# EAGLE design J-Link_PCB (EAGLE 9.6.2)
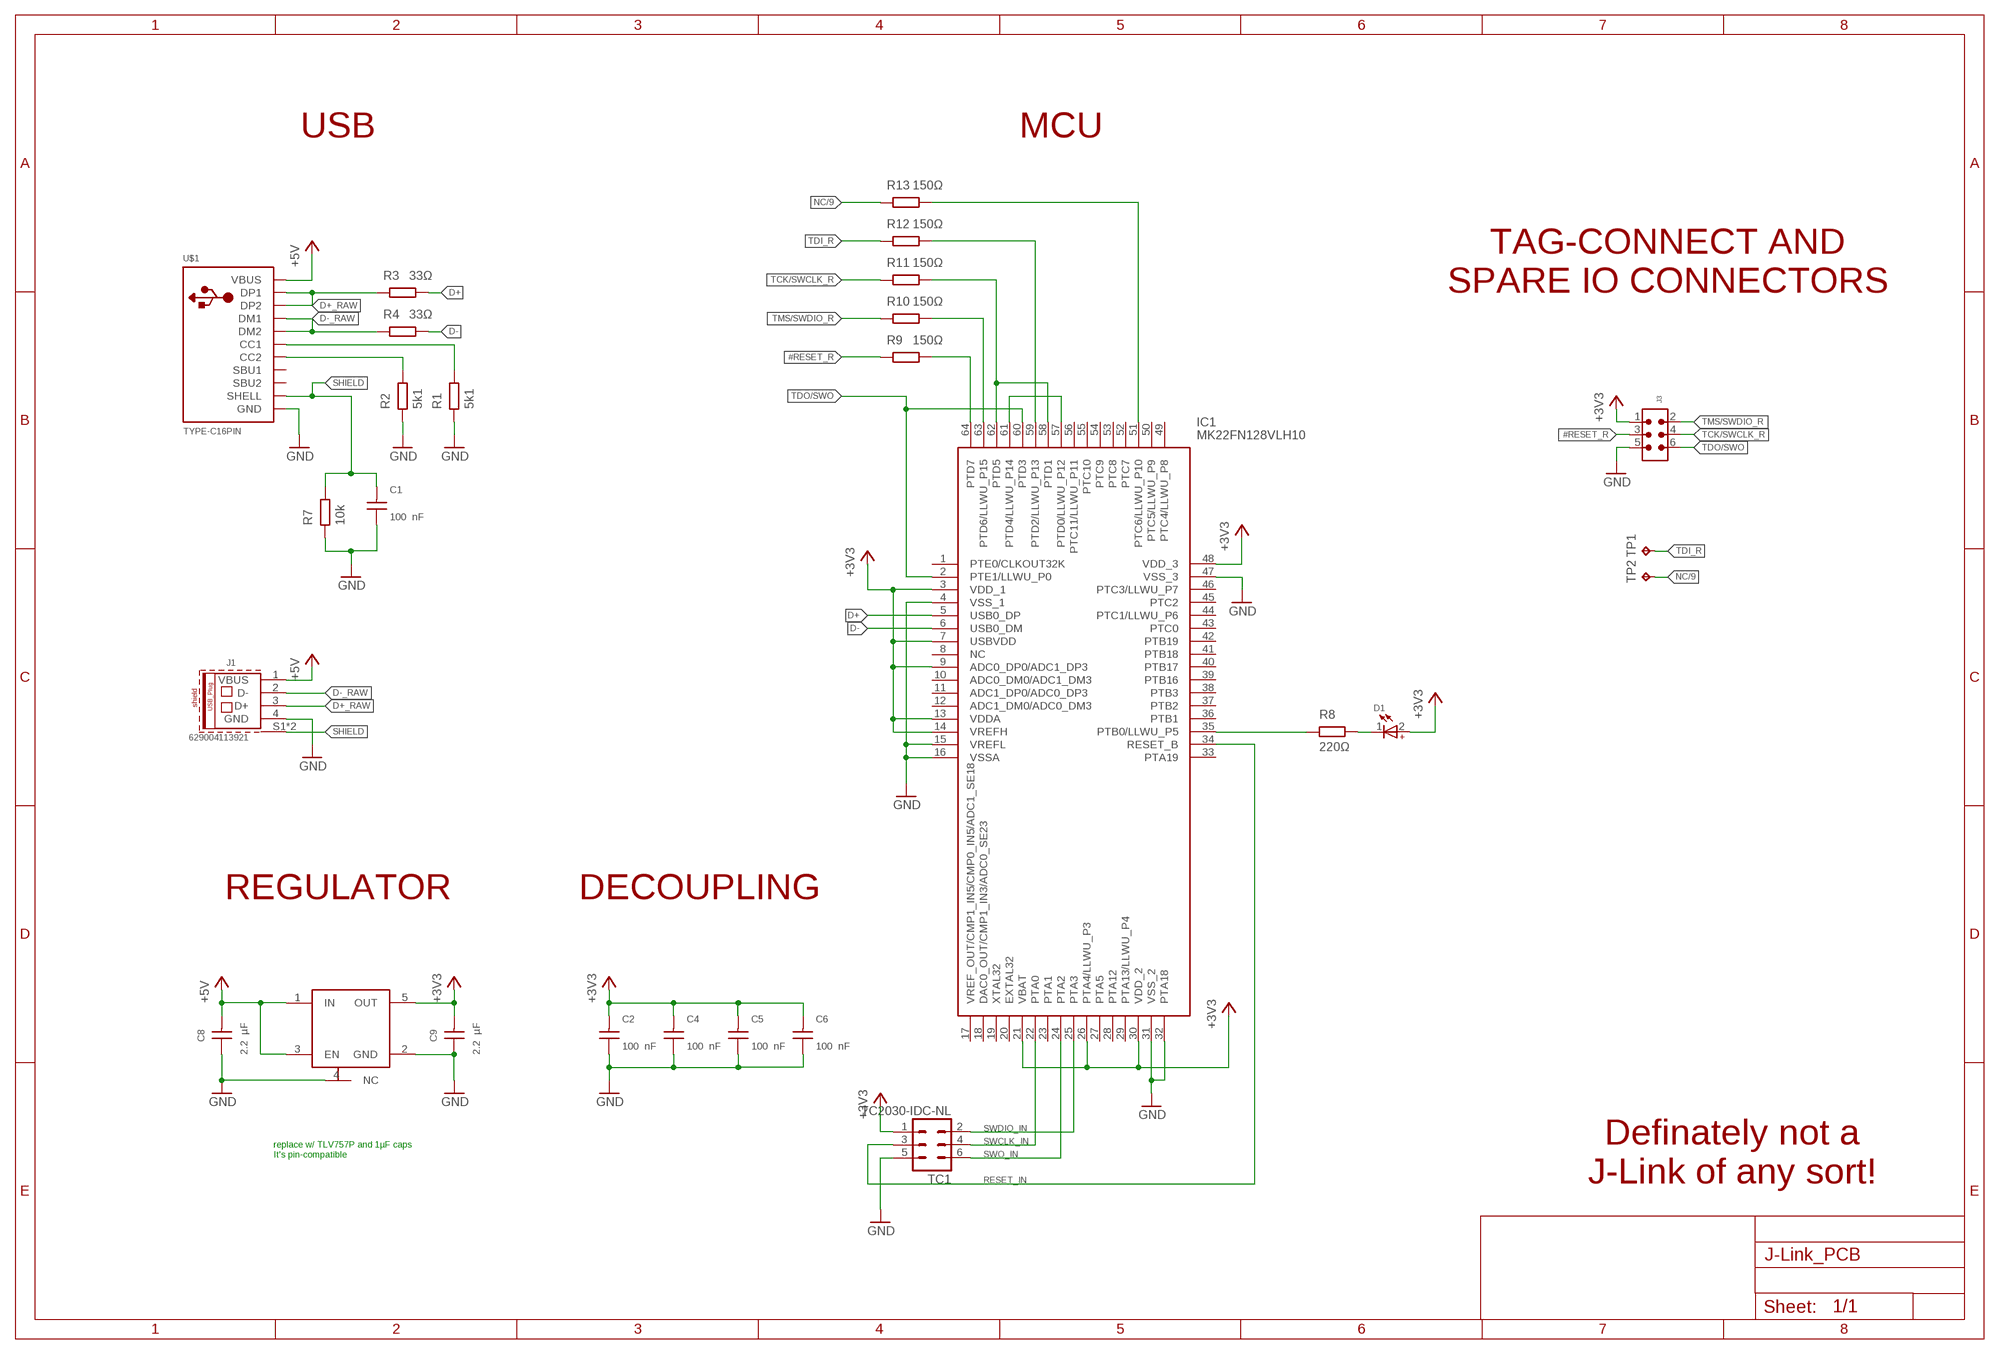
[diagram p0: schematic, sheet 1]

## Parts
C1  100 nF  WCAP-CSGP_0402_885012205037_16V(DC)  [WCAP-CSGP_0402]
C2  100 nF  WCAP-CSGP_0402_885012205037_16V(DC)  [WCAP-CSGP_0402]
C4  100 nF  WCAP-CSGP_0402_885012205037_16V(DC)  [WCAP-CSGP_0402]
C5  100 nF  WCAP-CSGP_0402_885012205037_16V(DC)  [WCAP-CSGP_0402]
C6  100 nF  WCAP-CSGP_0402_885012205037_16V(DC)  [WCAP-CSGP_0402]
C8  2.2 µF  WCAP-CSGP_0402_885012105013_10V(DC)  [WCAP-CSGP_0402]
C9  2.2 µF  WCAP-CSGP_0402_885012105013_10V(DC)  [WCAP-CSGP_0402]
D1  WL-SMCW_0603_150060BS75000  [WL-SMCW_0603]
IC1  MK22FN128VLH10  [QFP50P1200X1200X160-64N]
J1  629004113921  [629004113921]
J3  6120XX21621_61200621621  [61200621621]
R1  5k1  RESISTOR_0402  [WRIS-KSKE_0402]
R2  5k1  RESISTOR_0402  [WRIS-KSKE_0402]
R3  33Ω  RESISTOR_0402  [WRIS-KSKE_0402]
R4  33Ω  RESISTOR_0402  [WRIS-KSKE_0402]
R7  10k  RESISTOR_0402  [WRIS-KSKE_0402]
R8  220Ω  RESISTOR_0402  [WRIS-KSKE_0402]
R9  150Ω  RESISTOR_0402  [WRIS-KSKE_0402]
R10  150Ω  RESISTOR_0402  [WRIS-KSKE_0402]
R11  150Ω  RESISTOR_0402  [WRIS-KSKE_0402]
R12  150Ω  RESISTOR_0402  [WRIS-KSKE_0402]
R13  150Ω  RESISTOR_0402  [WRIS-KSKE_0402]
TC1  TC2030-IDC-NL  [TC2030-IDC-NL]
TP1  TPTP09R  [TP09R]
TP2  TPTP09R  [TP09R]
U$1  TYPE-C16PIN  [TYPE-C16PIN]
U$2  TLV75533PDBVRSOT-23-5  [DBV_R-PDSO-G5]

## Nets
#RESET: IC1.64(PTD7) R9.2
#RESET_R: J3.3 R9.1
+3V3: C2.2 C4.2 C5.2 C6.2 C9.2 D1.2(+) IC1.3(VDD_1) IC1.7(USBVDD) IC1.9(ADC0_DP0/ADC1_DP3) IC1.13(VDDA) IC1.14(VREFH) IC1.21(VBAT) IC1.26(PTA4/LLWU_P3) IC1.30(VDD_2) IC1.48(VDD_3) J3.1 TC1.1 U$2.5(OUT)
+5V: C8.2 J1.1(VBUS) U$1.A4B9(VBUS) U$1.B4A9(VBUS) U$2.1(IN) U$2.3(EN)
D+: IC1.5(USB0_DP) R3.2
D+_RAW: J1.3(D+) R3.1 U$1.A6(DP1) U$1.B6(DP2)
D-: IC1.6(USB0_DM) R4.2
D-_RAW: J1.2(D-) R4.1 U$1.A7(DM1) U$1.B7(DM2)
GND: C1.1 C2.1 C4.1 C5.1 C6.1 C8.1 C9.1 IC1.4(VSS_1) IC1.15(VREFL) IC1.16(VSSA) IC1.31(VSS_2) IC1.32(PTA18) IC1.47(VSS_3) J1.4(GND) J3.5 R1.1 R2.1 R7.1 TC1.5 U$1.A1B12(GND) U$1.B1A12(GND) U$2.2(GND) U$2.4(NC)
N$1: R2.2 U$1.B5(CC2)
N$2: R1.2 U$1.A5(CC1)
N$3: IC1.59(PTD2/LLWU_P13) R12.2
N$7: IC1.58(PTD1) IC1.62(PTD5) R11.2
N$8: IC1.57(PTD0/LLWU_P12) IC1.61(PTD4/LLWU_P14)
N$9: IC1.51(PTC6/LLWU_P10) R13.2
N$10: IC1.35(PTB0/LLWU_P5) R8.1
N$11: D1.1(-) R8.2
N$13: IC1.63(PTD6/LLWU_P15) R10.2
NC/9: R13.1 TP2.TP
RESET_IN: IC1.34(RESET_B) TC1.3
SHIELD: C1.2 J1.S1(SHIELD) J1.S2(SHIELD) R7.2 U$1.SHELL1(SHELL) U$1.SHELL2(SHELL) U$1.SHELL3(SHELL) U$1.SHELL4(SHELL)
SWCLK_IN: IC1.22(PTA0) TC1.4
SWDIO_IN: IC1.25(PTA3) TC1.2
SWO_IN: IC1.24(PTA2) TC1.6
TCK/SWCLK_R: J3.4 R11.1
TDI_R: R12.1 TP1.TP
TDO/SWO: IC1.2(PTE1/LLWU_P0) IC1.60(PTD3) J3.6
TMS/SWDIO_R: J3.2 R10.1
Unconnected: IC1.1(PTE0/CLKOUT32K) IC1.8(NC) IC1.10(ADC0_DM0/ADC1_DM3) IC1.11(ADC1_DP0/ADC0_DP3) IC1.12(ADC1_DM0/ADC0_DM3) IC1.17(VREF_OUT/CMP1_IN5/CMP0_IN5/ADC1_SE18) IC1.18(DAC0_OUT/CMP1_IN3/ADC0_SE23) IC1.19(XTAL32) IC1.20(EXTAL32) IC1.23(PTA1) IC1.27(PTA5) IC1.28(PTA12) IC1.29(PTA13/LLWU_P4) IC1.33(PTA19) IC1.36(PTB1) IC1.37(PTB2) IC1.38(PTB3) IC1.39(PTB16) IC1.40(PTB17) IC1.41(PTB18) IC1.42(PTB19) IC1.43(PTC0) IC1.44(PTC1/LLWU_P6) IC1.45(PTC2) IC1.46(PTC3/LLWU_P7) IC1.49(PTC4/LLWU_P8) IC1.50(PTC5/LLWU_P9) IC1.52(PTC7) IC1.53(PTC8) IC1.54(PTC9) IC1.55(PTC10) IC1.56(PTC11/LLWU_P11)

## Notes on the sheet
- USB | MCU
- TAG-CONNECT AND
  SPARE IO CONNECTORS
- REGULATOR | DECOUPLING
- replace w/ TLV757P and 1µF caps
  It's pin-compatible
- Definately not a
  J-Link of any sort!

## Power pins joined to a net without a drawn wire
SBU1: U$1.A8(SBU1)
SBU2: U$1.B8(SBU2)

## Library data of the parts
C1 C2 C4-C6 = Wurth_Capacitors_WCAP-CSGP:WCAP-CSGP_0402: WCAP-CSGP MLCCs 0402 General Purpose Characteristics High performance ceramic High electrical precision and stability ceramic especially for NP0 Minimal aging especially for NP0 Mounting style: SMT-Chip Ceramic: NP0 (Class I), X5R (Class II), X7R (Class II) Capacitance range: 1 pF ‒ 10 µF Temperature Coefficient: ±30 ppm/°C; ±0.54 % for NP0 ±15 % for X5R and X7R Voltage range (UR): 6.3 ‒ 100 V(DC) Operating temperature: -55 °C up to + 125 °C for NP0 and X7R -55 °C up to + 85 °C for X5R Termination: Cu/Ni/Sn Recommended soldering: Reflow soldering Applications Temperature compensation (NP0) Coupling Decoupling Bypass Smoothing Filtering Resonant circuit <https://www.we-online.com/catalog/media/o157810v209%20Family_WE-MLCC_0805_weiss.jpg> Details see: https://www.we-online.com/catalog/en/WCAP-CSGP-0402/ Updated by yingchun,Shan;2020-03-06 2020(C) Würth Elektronik; CERAMIC-TYPE: X7R Class II; DATASHEET-URL: https://www.we-online.com/catalog/datasheet/885012205037.pdf; DF: 5%; H: 0.5mm; OPERATING-TEMPERATURE: -55 °C up to +125 °C; PART-NUMBER: 885012205037; QMIN: -; RISO: 5 GOhm; TECHNICAL-REFERENCE: X7R0402104K016DFCT10000; TOL-VALUE: ±10%; VR: 16V(DC)
C8 C9 = Wurth_Capacitors_WCAP-CSGP:WCAP-CSGP_0402: WCAP-CSGP MLCCs 0402 General Purpose Characteristics High performance ceramic High electrical precision and stability ceramic especially for NP0 Minimal aging especially for NP0 Mounting style: SMT-Chip Ceramic: NP0 (Class I), X5R (Class II), X7R (Class II) Capacitance range: 1 pF ‒ 10 µF Temperature Coefficient: ±30 ppm/°C; ±0.54 % for NP0 ±15 % for X5R and X7R Voltage range (UR): 6.3 ‒ 100 V(DC) Operating temperature: -55 °C up to + 125 °C for NP0 and X7R -55 °C up to + 85 °C for X5R Termination: Cu/Ni/Sn Recommended soldering: Reflow soldering Applications Temperature compensation (NP0) Coupling Decoupling Bypass Smoothing Filtering Resonant circuit <https://www.we-online.com/catalog/media/o157810v209%20Family_WE-MLCC_0805_weiss.jpg> Details see: https://www.we-online.com/catalog/en/WCAP-CSGP-0402/ Updated by yingchun,Shan;2020-03-06 2020(C) Würth Elektronik; CERAMIC-TYPE: X5R Class II; DATASHEET-URL: https://www.we-online.com/catalog/datasheet/885012105013.pdf; DF: 10%; H: 0.5mm; OPERATING-TEMPERATURE: -55 °C up to +85 °C; PART-NUMBER: 885012105013; QMIN: -; RISO: 0.05GOhm; TECHNICAL-REFERENCE: X5R0402225M010DFCT10000; TOL-VALUE: ±20%; VR: 10V(DC)
D1 = 150080BS75000_Eagle_WL-SMCW_rev20b:WL-SMCW_0603: WL-SMCW SMT Mono-color Chip LED Waterclea Characteristics Low energy consumption High reliability Low current requirement Fast switching No UV/IR radiation Smallest SMD LED package for exceptional brightness Top view LED Wide viewing angle Better solder ability Heat dissipation Applications Backlight for mobile and portable device keypads Indoor and outdoor message boards Flat backlight for LCDs, switches and symbols Display for industrial control systems and traffic Miniaturized color effects Pedestrian mark Optical indicators Tabular backlight: LCD, telephone key-press, power-switch, display board Indoor displays Signals Identifiers Backlight for automobile DVD LED General lighting Toys <https://www.we-online.com/catalog/media/o14904v209%20Family_WL-SMCW.jpg> Details see: https://www.we-online.com/catalog/en/WL-SMCW/ Updated BY Yingchun,Shan 2020-03-18 2020(C) Wurth Elektronik; ABSTRAHLWINKEL: 140°; CHIP-TECHNOLOGY: InGaN; DATASHEET-URL: https://www.we-online.com/catalog/datasheet/150060BS75000.pdf; EMITTING-COLOR: Blue; I-V-TYP: 145mcd; LAMDA-DOM-TYP: 470nm; LAMDA-PEAK-TYP: 465nm; PART-NUMBER: 150060BS75000; V-F-TYP: 3.2V
IC1 = Salmiak:MK22FN128VLH10: NXP MK22FN128VLH10, 32bit ARM Cortex M4 MCU, 100MHz, 128 kB Flash, 64-Pin LQFP Source: Datasheet <http://www.nxp.com/docs/en/data-sheet/K22P121M100SF9.pdf>; ARROW_PART_NUMBER: MK22FN128VLH10; ARROW_PRICE-STOCK: http://www.arrow.com/en/products/mk22fn128vlh10/nxp-semiconductors; DESCRIPTION: NXP MK22FN128VLH10, 32bit ARM Cortex M4 MCU, 100MHz, 128 kB Flash, 64-Pin LQFP; HEIGHT: 1.6mm; MANUFACTURER_NAME: NXP; MANUFACTURER_PART_NUMBER: MK22FN128VLH10; MOUSER_PART_NUMBER: 841-MK22FN128VLH10; MOUSER_PRICE-STOCK: https://www.mouser.co.uk/ProductDetail/NXP-Semiconductors/MK22FN128VLH10?qs=asPD7ZL2j3WXe0xJjNvhDw%3D%3D
J1 = Wurth_Connectors_WR-USB:629004113921: WR-COM USB 2.0 Plug Type A SMT w. Clip Kind Properties Durability:1 500 Mating cycles Connector Type:USB Gender:Plug Type:Horizontal General Information Operating Temperature:-55 up to +105 °C Electrical Properties Working Voltage:30V (AC) Withstanding Voltage:750 V (AC) Contact Resistance:20 mΩ Material Properties Insulator Material:LCP Insulator Flammability Rating:UL94 V-0 Insulator Color:Black Contact Material:Copper Alloy Contact Plating:Selective Gold Contact Type:Stamped Shielding Material:Brass Shielding Plating:Nickel <https://www.we-online.com/catalog/media/o32993v209%20Family_WR-COM_629004113921.jpg> Details see: https://www.we-online.com/catalog/en/COM_PLUG_SMT_TYPE_A_W_CLIP/ Updated by Yingchun, Shan 2020-01-14 2020 (C) Würth Elektronik; APPLICATION: USB 2.0; DATASHEET-URL: https://www.we-online.com/catalog/datasheet/629004113921.pdf; GERDER: Plug; INTERFACE-TYPE: Type A; IR1: 1.5A; MOUNT: SMT; PACKAGING: Tube; PART-NUMBER: 629004113921; PINS: 4; TYPE: Horizontal; WORKING-VOLTAGE: 30V(AC)
J3 = 61200621621_Eagle_WR-BHD_rev19b:6120XX21621_61200621621: WR-BHD 2.54 mm Male Box Header KIND PROPERTIES: Pitch 2.54 mm Gender:Male MATERIAL PROPERTIES: Insulator Material:PBT Insulator Flammability Rating UL94 V-0 Insulator Color:Black Contact Material :Copper Alloy Contact Plating :Gold Contact Type: Stamped GENERAL INFORMATION: Operating Temperature:-40 °C up to +125 °C Compliance:RoHS Working Voltage: 250 V (AC) Withstanding Voltage:500 V (AC) Contact Resistance: 20 mΩ Insulation Resistance:1000 MΩ CERTIFICATION: UL Approval:E323964 PACKAGING PROPERTIES Packaging :Tray <https://katalog.we-online.com/media/images/v2/o32884v209%20Family_WR-BHD_6120xx21621.jpg> Details see: https://katalog.we-online.com/en/em/BHD_2_54_MALE_BOX_HEADER_6120XX21621 Updated by Yingchun,Shan 2019-10-29 2019 (C) Würth Elektronik; CONTACT-RESISTANCE: 20mOhm; DATASHEET-URL: https://katalog.we-online.com/em/datasheet/61200621621.pdf; GENDER: Male; IR: 3A; L: 15.28mm; MATES: WR-BHD 2.54mm Female IDC Connector with Strain Relief; MOUNT: THT; PACKAGING: Tray; PART-NUMBER: 61200621621; PINS: 6; PITCH: 2.54mm; TOL-R: max.; TYPE: Straight; WORKING-VOLTAGE: 250V(AC)
R1-R4 R7-R13 = Lib_A:RESISTOR_0402
TC1 = TagConnect:TC2030-IDC: Tag-Connect In Circuit Programming & Debug Cable 6 Pin http://www.tag-connect.com
TP1 TP2 = testpad:TP: Test pad
U$1 = Lib_A:TYPE-C16PIN
U$2 = Eigene Bauteile:TLV75533PDBVR

## Board
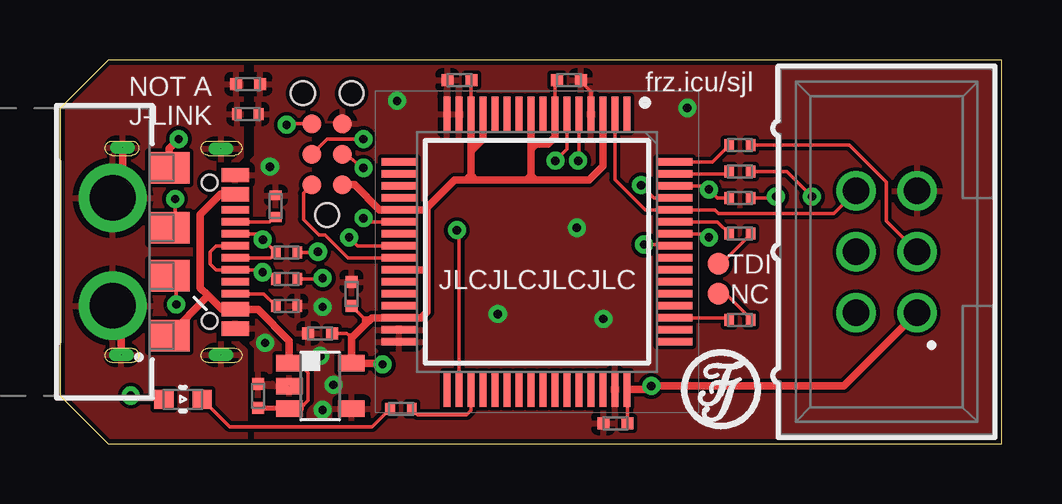
[diagram p1: board, top side]
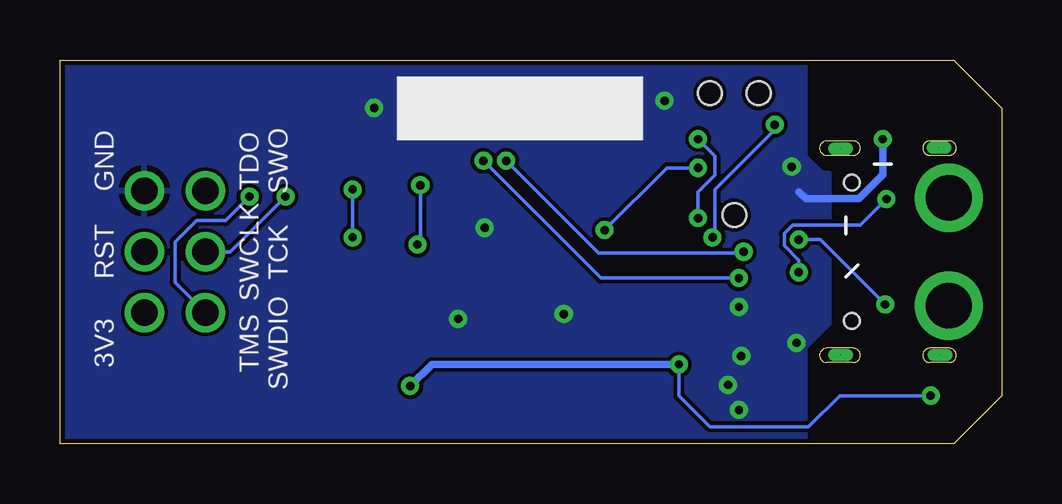
[diagram p2: board, bottom side, seen from below]

Size 39.25 x 16 mm. Coordinates in mm from the lower left corner, seen from the top.
Outline: 2,0 39.25,0 39.25,16 2,16 0,14 0,2 2,0
Copper layers (1*16): Top 0.035mm / dielectric 1.5mm / Bottom 0.035mm
Design rules "default *": minimum track width 6mil, minimum drill 0.35mm, track to track 6mil, track to pad 6mil, pad to pad 6mil, via to via 6mil, smd to smd 6mil, copper to edge 0.2mm, drill to drill 6mil, minimum pad ring 10mil, minimum via ring 8mil, stop-mask expansion 4mil, vias tented up to drill 110mil, thermal gap 10mil

### Footprints (pad centres in the part's own frame; a part is rotated, then mirrored left to right if it is on the bottom)
WCAP-CSGP_0402 = smd 0.5 x 0.5: 1 0.5,0; 2 -0.5,0
WL-SMCW_0603 = smd 0.8 x 0.8: 1 -0.8,0; 2 0.8,0
QFP50P1200X1200X160-64N = smd 1.475 x 0.3: 1 -5.738,3.75; 2 -5.738,3.25; 3 -5.738,2.75; 4 -5.738,2.25; 5 -5.738,1.75; 6 -5.738,1.25; 7 -5.738,0.75; 8 -5.738,0.25; 9 -5.738,-0.25; 10 -5.738,-0.75; 11 -5.738,-1.25; 12 -5.738,-1.75; 13 -5.738,-2.25; 14 -5.738,-2.75; 15 -5.738,-3.25; 16 -5.738,-3.75; 33 5.738,-3.75; 34 5.738,-3.25; 35 5.738,-2.75; 36 5.738,-2.25; 37 5.738,-1.75; 38 5.738,-1.25; 39 5.738,-0.75; 40 5.738,-0.25; 41 5.738,0.25; 42 5.738,0.75; 43 5.738,1.25; 44 5.738,1.75; 45 5.738,2.25; 46 5.738,2.75; 47 5.738,3.25; 48 5.738,3.75 | smd 0.3 x 1.475: 17 -3.75,-5.738; 18 -3.25,-5.738; 19 -2.75,-5.738; 20 -2.25,-5.738; 21 -1.75,-5.738; 22 -1.25,-5.738; 23 -0.75,-5.738; 24 -0.25,-5.738; 25 0.25,-5.738; 26 0.75,-5.738; 27 1.25,-5.738; 28 1.75,-5.738; 29 2.25,-5.738; 30 2.75,-5.738; 31 3.25,-5.738; 32 3.75,-5.738; 49 3.75,5.738; 50 3.25,5.738; 51 2.75,5.738; 52 2.25,5.738; 53 1.75,5.738; 54 1.25,5.738; 55 0.75,5.738; 56 0.25,5.738; 57 -0.25,5.738; 58 -0.75,5.738; 59 -1.25,5.738; 60 -1.75,5.738; 61 -2.25,5.738; 62 -2.75,5.738; 63 -3.25,5.738; 64 -3.75,5.738
629004113921 = smd 1.3 x 1.7: 1 3.5,10.2; 2 1,10.2; 3 -1,10.2; 4 -3.5,10.2 | drill 1.9: S1 -2.25,7.85; S2 2.25,7.85
61200621621 = drill 1.1: 1 -2.54,-1.27; 2 -2.54,1.27; 3 0,-1.27; 4 0,1.27; 5 2.54,-1.27; 6 2.54,1.27
WRIS-KSKE_0402 = smd 0.4 x 0.5: 1 -0.45,0; 2 0.45,0
TC2030-IDC-NL = smd 0.787 x 0.787: 1 -1.27,-0.635; 2 -1.27,0.635; 3 0,-0.635; 4 0,0.635; 5 1.27,-0.635; 6 1.27,0.635 | hole 0.991: -2.54,0; 2.54,1.016; 2.54,-1.016
TP09R = smd 0.9 x 0.9: TP 0,0
TYPE-C16PIN = smd 0.6 x 1.15: A1B12 -3.2,0; A4B9 -2.4,0; B1A12 3.2,0; B4A9 2.4,0 | smd 0.3 x 1.15: A5 -1.25,0; A6 -0.25,0; A7 0.25,0; A8 -1.75,0; B5 1.75,0; B6 0.75,0; B7 -0.75,0; B8 1.25,0 | drill 0.01 long: SHELL1 -4.3,-0.6; SHELL2 4.3,-0.6; SHELL3 -4.35,-4.7; SHELL4 4.3,-4.75 | hole 0.65: -2.89,-1.075; 2.89,-1.075
DBV_R-PDSO-G5 = smd 0.69 x 1.1: 1 -0.95,-1.29; 2 0,-1.29; 3 0.95,-1.29; 4 0.95,1.3; 5 -0.95,1.3

### Placement (x,y rotation side)
C1  7.85,15 0 top
C2  21.21,15.15 0 top
C4  23.15,0.85 180 top
C5  12.15,6.25 90 top
C6  16.65,15.15 180 top
C8  8.25,2 90 top
C9  10.85,4.6 180 top
D1  5.13,1.85 180 top
IC1  19.88,8 270 top
J1  -5.65,8 270 top
J3  34.46,8 90 top
R1  8.99,9.9 270 top
R2  9.45,5.74 180 top
R3  9.45,6.86 0 top
R4  9.45,7.96 0 top
R7  7.83,13.74 180 top
R8  14.21,1.44 180 top
R9  28.35,12.45 180 top
R10  28.35,11.35 180 top
R11  28.35,10.25 180 top
R12  28.35,8.76 180 top
R13  28.35,5.16 180 top
TC1  11.14,12.07 90 top
TP1  27.45,7.5 0 top
TP2  27.45,6.25 0 top
U$1  7.31,8 270 top
U$2  10.85,2.4 270 top

### Tracks (layer width: path | path; a pad name or v marks a point on that pad's centre or on a via)
#RESET
  Top 0.152: IC1.64 27.2,11.75 R9.2
#RESET_R
  Top 0.152: J3.3 34.45,9.28 34.45,10.9 32.9,12.45 R9.1
+3V3  (via drill 0.35)
  Top 0.152: 17.13,15.13 IC1.14 | 20.63,15.07 IC1.7 | D1.2 3.1,1.85 v2.95,2 | IC1.48 23.65,2.24 C4.2 | 12.27,4.58 12.27,4.53 12.02,4.53 | 12.15,4.4 12.02,4.53 | 12.02,4.53 11.95,4.6 C9.2 | C5.2 12.65,5.25 | 12.65,5.25 13,5.25 | 12.65,5.25 12.65,4.9
  Top 0.305: v13.45,3.3 13.4,3.35 U$2.5 12.15,4.4 12.27,4.53 12.65,4.9 13,5.25 IC1.30 15.05,5.25 15.3,5.5 15.3,7.25 | IC1.48 24.51,2.26 v24.65,2.4 32.67,2.4 J3.1 | TC1.1 12.27,10.8 13.32,9.75 IC1.21 15.2,9.75 | IC1.13 17.63,12.7 17.44,12.51 | IC1.7 20.63,12.78 20.35,12.5 19.85,12.5 | 19.83,12.5 19.65,12.5 19.63,12.52 | IC1.9 19.63,12.7 | 19.63,12.7 19.63,12.52 | C6.2 17.13,15.13 | C2.2 20.63,15.07 | IC1.3 22.63,11.58 22.05,11 19.8,11 | 19.8,11 19.45,11 | 19.45,11 17.33,11 | 17.33,11 17.15,11 | IC1.26 15.3,7.25 | 17.15,11 16.93,11 | 16.93,11 16.45,11 15.45,10 15.3,9.85 | 17.13,13 IC1.14 17.13,12.65 | 17.13,12.65 17.13,12.25 | 17.13,12.25 17.13,11.2 | 17.13,11.2 17.13,11.02 17.15,11 | 17.44,12.51 17.18,12.25 17.13,12.25 | 16.93,11 17.13,11.2 | 17.33,11 17.13,11.2 | 19.63,12.52 19.63,12.28 | 19.63,12.28 19.63,11.18 | 19.45,11 19.63,11.18 | 19.63,11.18 19.8,11.01 19.8,11 | 19.63,12.28 19.85,12.5 | 19.85,12.5 19.83,12.5 | 19.83,12.5 19.63,12.7 | 17.13,12.65 17.27,12.51 17.44,12.51 | 15.2,9.75 15.3,9.85 | 15.3,7.25 15.3,9.65 | 15.3,9.65 15.2,9.75 | 15.3,9.85 15.3,9.65
  Bottom 0.152: v2.95,2 6.75,2 8.05,0.7 12.15,0.7 13.45,2 v13.45,3.3
  Bottom 0.305: v13.45,3.3 23.75,3.3 v24.65,2.4
+5V
  Top 0.152: 9.95,3.35 10.35,2.95 10.35,1.8 10,1.45
  Top 0.203: C8.2 9.51,1.5 U$2.3
  Top 0.305: 6.15,6.2 6.75,5.6 U$1.B4A9 8.25,5.6 9.56,4.29 U$2.1 9.95,3.35 | 6.15,6.2 5.85,6.5 5.85,9.55 6.7,10.4 U$1.A4B9 | 10,1.45 U$2.3 | J1.1 6.15,6.15 6.15,6.2
D+  (via drill 0.35)
  Top 0.152: R3.2 10.91,6.86 v10.95,6.9 | IC1.5 21.63,11.83 v21.6,11.8
  Bottom 0.152: v10.95,6.9 16.7,6.9 v21.6,11.8
D+_RAW  (via drill 0.35)
  Top 0.152: 8.45,7.25 U$1.B6 6.5,7.25 6.25,7.5 6.25,8 6.5,8.25 U$1.A6 | 8.45,7.25 8.61,7.25 R3.1 | v4.8,10.2 4.8,9.25 J1.3 | v8.45,7.14 8.45,7.25
  Bottom 0.152: v4.8,10.2 5.89,9.11 8.71,9.11 9.06,8.76 9.06,8.25 8.45,7.64 v8.45,7.14
D-  (via drill 0.35)
  Top 0.152: R4.2 10.71,7.96 v10.75,8 | v20.65,11.8 21.13,12.28 IC1.6
  Bottom 0.152: v10.75,8 10.9,8 10.95,7.95 16.8,7.95 v20.65,11.8
D-_RAW  (via drill 0.35)
  Top 0.152: U$1.A7 8.79,7.75 R4.1 v8.45,8.51 8.21,8.75 U$1.B7 | J1.2 4.85,6.7 v4.85,5.8
  Bottom 0.152: v4.85,5.8 7.55,8.51 v8.45,8.51
GND  (via drill 0.35)
  Top 0.152: IC1.4 22.13,14.68 21.71,15.1 C2.1
  Top 0.305: J1.4 4.55,12.3 v4.95,12.7
  Bottom 0.305: v4.95,12.7 4.95,11.22 5.95,10.21 8.16,10.21 8.45,10.5
  other vias: 8.55,4.2 10.95,5.7 8.75,11.55 14.05,14.3 18.25,5.4 21.55,9 22.65,5.2 26.15,14 11.4,2.45 10.85,3.65 10.95,1.4
  pour Bottom: 8.15,0 8.15,4 7.15,5 7.15,11.3 7.45,11.3 8.15,12 8.15,16 39.25,16 39.25,0
  pour Top: 8.15,0 8.15,4 7.15,5 7.15,11.3 7.45,11.3 8.15,12 8.15,16 39.25,16 39.25,0
N$1
  Top 0.152: U$1.B5 8.49,6.25 R2.2
N$2
  Top 0.152: U$1.A5 8.74,9.25 8.94,9.45 R1.2
N$3
  Top 0.152: R12.2 27.41,9.25 IC1.59
N$7  (via drill 0.35)
  Top 0.152: R11.2 27.4,10.25 v27.05,10.6 26.9,10.75 IC1.62 | v27.05,8.6 26.9,8.75 IC1.58
  Bottom 0.152: v27.05,10.6 v27.05,8.6
N$8  (via drill 0.35)
  Top 0.152: IC1.61 24.76,10.25 v24.23,10.78 | v24.35,8.3 25.57,8.3 IC1.57
  Bottom 0.152: v24.23,10.78 24.23,8.42 v24.35,8.3
N$9
  Top 0.152: R13.2 27.81,5.25 IC1.51
N$10
  Top 0.152: IC1.35 17.13,1.38 16.95,1.2 14.9,1.2 R8.1
N$11
  Top 0.152: R8.2 13.02,0.7 7.08,0.7 D1.1
N$13
  Top 0.152: IC1.63 27.8,11.25 R10.2
NC/9
  Top 0.152: R13.1 28.8,5.2 27.75,6.25 TP2.TP
RESET_IN  (via drill 0.35)
  Top 0.152: TC1.3 11.88,12.07 v12.65,11.5 | v16.55,8.9 16.63,8.82 IC1.34
  Bottom 0.152: v12.65,11.5 13.95,11.5 v16.55,8.9
SHIELD
  Top 0.305: U$1.SHELL4 2.56,5.44 J1.S2 | U$1.SHELL3 2.61,10.71 J1.S1
  pour Top: 7.75,0 7.75,3.9 7.45,4.2 6.45,4.2 6.45,11.8 7.45,11.8 7.6,11.95 7.6,16 2,16 0,14 0,2 2,0
SWCLK_IN  (via drill 0.35)
  Top 0.152: TC1.4 11.13,12.7 v12.65,12.7 | IC1.22 12.8,9.25 v12.65,9.4
  Bottom 0.152: v12.65,12.7 11.95,12 11.95,11.2 12.65,10.5 v12.65,9.4
SWDIO_IN
  Top 0.152: TC1.2 10.15,10.45 10.15,9.35 10.8,8.7 11.05,8.7 12,7.75 IC1.25
SWO_IN  (via drill 0.35)
  Top 0.152: IC1.24 12.4,8.25 v12.05,8.6 | TC1.6 9.49,13.34 v9.45,13.3
  Bottom 0.152: v12.05,8.6 11.95,8.7 11.95,10.6 9.45,13.1 v9.45,13.3
TCK/SWCLK_R  (via drill 0.35)
  Top 0.152: R11.1 29.8,10.25 v29.85,10.3
  Bottom 0.152: v29.85,10.3 32.15,8 J3.4
TDI_R
  Top 0.152: R12.1 27.55,7.5 TP1.TP
TDO/SWO
  Top 0.152: IC1.2 23.13,11.02 24.4,9.75 IC1.60 27.3,9.75 27.45,9.6 32.25,9.6 J3.6
TMS/SWDIO_R  (via drill 0.35)
  Top 0.152: R10.1 30.3,11.35 v31.35,10.3
  Bottom 0.152: v31.35,10.3 32.35,9.3 33.55,9.3 34.45,8.4 34.45,6.72 J3.2

### Text on the board
tNames: frz.icu/sjl | NOT A / J-LINK | TDI | JLCJLCJLCJLC | NC
bNames: TDO / SWO | GND | SWCLK / TCK | RST | TMS / SWDIO | 3V3